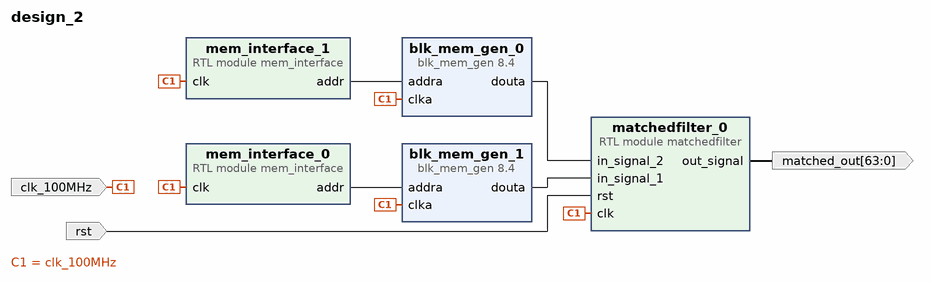
[diagram p0: block diagram of the top level]
# Vivado block design design_2, xc7z010clg400-2, Vivado 2025.2
create_bd_design design_2

create_bd_port -dir I -type clk clk_100MHz
set_property -dict {CONFIG.FREQ_HZ 100000000} [get_bd_ports clk_100MHz]
create_bd_port -dir O -from 63 -to 0 matched_out
create_bd_port -dir I rst

create_bd_cell -type ip -vlnv xilinx.com:ip:blk_mem_gen:8.4 blk_mem_gen_0
set_property -dict [list \
  CONFIG.Coe_File ../../../../Matlab/Signal/Signal_1.coe \
  CONFIG.Enable_A Always_Enabled \
  CONFIG.Fill_Remaining_Memory_Locations false \
  CONFIG.Load_Init_File true \
  CONFIG.Read_Width_A 16 \
  CONFIG.Use_RSTA_Pin false \
  CONFIG.Write_Depth_A 2048 \
  CONFIG.Write_Width_A 16 \
  CONFIG.use_bram_block Stand_Alone \
] [get_bd_cells blk_mem_gen_0]
create_bd_cell -type ip -vlnv xilinx.com:ip:blk_mem_gen:8.4 blk_mem_gen_1
set_property -dict [list \
  CONFIG.Coe_File ../../../../Matlab/Signal/Signal_1.coe \
  CONFIG.Enable_A Always_Enabled \
  CONFIG.Fill_Remaining_Memory_Locations false \
  CONFIG.Load_Init_File true \
  CONFIG.Read_Width_A 16 \
  CONFIG.Use_RSTA_Pin false \
  CONFIG.Write_Depth_A 2048 \
  CONFIG.Write_Width_A 16 \
  CONFIG.use_bram_block Stand_Alone \
] [get_bd_cells blk_mem_gen_1]
create_bd_cell -type module -reference matchedfilter matchedfilter_0
set_property -dict {CONFIG.DATA_SIZE 16} [get_bd_cells matchedfilter_0]
create_bd_cell -type module -reference mem_interface mem_interface_0
create_bd_cell -type module -reference mem_interface mem_interface_1

# ---- connections ----

connect_bd_net [get_bd_ports clk_100MHz] \
  [get_bd_pins blk_mem_gen_1/clka] [get_bd_pins blk_mem_gen_0/clka] [get_bd_pins mem_interface_1/clk] \
  [get_bd_pins mem_interface_0/clk] [get_bd_pins matchedfilter_0/clk]
connect_bd_net [get_bd_pins blk_mem_gen_0/douta] [get_bd_pins matchedfilter_0/in_signal_2]
connect_bd_net [get_bd_pins blk_mem_gen_1/douta] [get_bd_pins matchedfilter_0/in_signal_1]
connect_bd_net [get_bd_pins matchedfilter_0/out_signal] [get_bd_ports matched_out]
connect_bd_net [get_bd_pins mem_interface_0/addr] [get_bd_pins blk_mem_gen_1/addra]
connect_bd_net [get_bd_pins mem_interface_1/addr] [get_bd_pins blk_mem_gen_0/addra]
connect_bd_net [get_bd_ports rst] [get_bd_pins matchedfilter_0/rst]

validate_bd_design
save_bd_design
